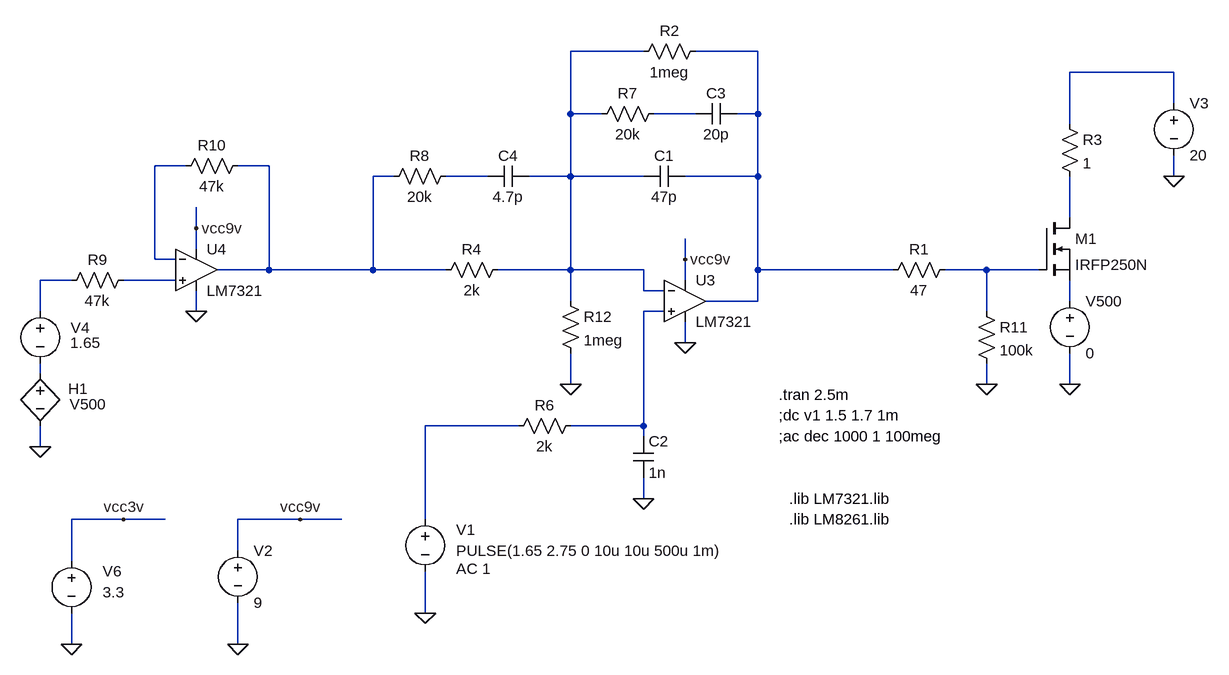
[diagram p0: schematic power_mosfet.asc]
power_mosfet.asc, the LTspice schematic file:
Version 4
SHEET 1 880 1104
WIRE -864 -128 -976 -128
WIRE -688 -128 -784 -128
WIRE -48 -96 -208 -96
WIRE -48 -48 -48 -96
WIRE -976 -32 -976 -128
WIRE -928 -32 -976 -32
WIRE -784 -32 -848 -32
WIRE -688 -32 -688 -128
WIRE -688 -32 -720 -32
WIRE -208 -16 -208 -96
WIRE -1568 48 -1616 48
WIRE -1440 48 -1488 48
WIRE -1248 64 -1280 64
WIRE -1104 64 -1168 64
WIRE -976 64 -976 -32
WIRE -976 64 -1040 64
WIRE -864 64 -976 64
WIRE -688 64 -688 -32
WIRE -688 64 -800 64
WIRE -48 64 -48 32
WIRE -208 128 -208 64
WIRE -1552 144 -1552 112
WIRE -1552 176 -1552 144
WIRE -1616 192 -1616 48
WIRE -1584 192 -1616 192
WIRE -800 192 -800 160
WIRE -1440 208 -1440 48
WIRE -1440 208 -1520 208
WIRE -1280 208 -1280 64
WIRE -1280 208 -1440 208
WIRE -1168 208 -1280 208
WIRE -976 208 -976 64
WIRE -976 208 -1088 208
WIRE -864 208 -976 208
WIRE -688 208 -688 64
WIRE -480 208 -688 208
WIRE -336 208 -400 208
WIRE -256 208 -336 208
WIRE -1744 224 -1792 224
WIRE -1584 224 -1664 224
WIRE -800 224 -800 192
WIRE -864 240 -864 208
WIRE -832 240 -864 240
WIRE -976 256 -976 208
WIRE -688 256 -688 208
WIRE -688 256 -768 256
WIRE -208 256 -208 224
WIRE -1792 272 -1792 224
WIRE -1552 272 -1552 240
WIRE -832 272 -864 272
WIRE -336 272 -336 208
WIRE -800 320 -800 288
WIRE -1792 368 -1792 352
WIRE -976 384 -976 336
WIRE -336 384 -336 352
WIRE -208 384 -208 336
WIRE -1056 448 -1200 448
WIRE -864 448 -864 272
WIRE -864 448 -976 448
WIRE -864 464 -864 448
WIRE -1792 480 -1792 448
WIRE -864 560 -864 528
WIRE -1664 592 -1744 592
WIRE -1600 592 -1664 592
WIRE -1392 592 -1488 592
WIRE -1328 592 -1392 592
WIRE -1200 592 -1200 448
WIRE -1488 640 -1488 592
WIRE -1744 656 -1744 592
WIRE -1200 736 -1200 672
WIRE -1744 784 -1744 736
WIRE -1488 784 -1488 720
FLAG -208 384 0
FLAG -48 64 0
FLAG -1792 480 0
FLAG -800 320 0
FLAG -800 192 vcc9v
FLAG -976 384 0
FLAG -336 384 0
FLAG -1488 784 0
FLAG -1392 592 vcc9v
FLAG -1552 272 0
FLAG -1552 144 vcc9v
FLAG -1744 784 0
FLAG -1664 592 vcc3v
FLAG -1200 736 0
FLAG -864 560 0
SYMBOL nmos -256 128 R0
SYMATTR InstName M1
SYMATTR Value IRFP250N
SYMBOL res -496 224 R270
WINDOW 0 32 56 VTop 2
WINDOW 3 0 56 VBottom 2
SYMATTR InstName R1
SYMATTR Value 47
SYMBOL voltage -48 -64 R0
WINDOW 123 0 0 Left 2
WINDOW 39 0 0 Left 2
SYMATTR InstName V3
SYMATTR Value 20
SYMBOL res -224 -32 R0
SYMATTR InstName R3
SYMATTR Value 1
SYMBOL h -1792 352 R0
WINDOW 0 43 39 Left 2
WINDOW 3 45 63 Left 2
SYMATTR InstName H1
SYMATTR Value V500
SYMATTR Value2 110m
SYMBOL voltage -208 240 R0
WINDOW 123 0 0 Left 2
WINDOW 39 0 0 Left 2
SYMATTR InstName V500
SYMATTR Value 0
SYMBOL voltage -1792 256 R0
WINDOW 0 47 41 Left 2
WINDOW 3 46 64 Left 2
WINDOW 123 0 0 Left 2
WINDOW 39 0 0 Left 2
SYMATTR InstName V4
SYMATTR Value 1.65
SYMBOL res -1184 224 R270
WINDOW 0 32 56 VTop 2
WINDOW 3 0 56 VBottom 2
SYMATTR InstName R4
SYMATTR Value 2k
SYMBOL cap -864 80 R270
WINDOW 0 32 32 VTop 2
WINDOW 3 0 32 VBottom 2
SYMATTR InstName C1
SYMATTR Value 47p
SYMBOL res -880 -112 R270
WINDOW 0 32 56 VTop 2
WINDOW 3 0 56 VBottom 2
SYMATTR InstName R2
SYMATTR Value 1meg
SYMBOL res -944 -16 R270
WINDOW 0 32 56 VTop 2
WINDOW 3 0 56 VBottom 2
SYMATTR InstName R7
SYMATTR Value 20k
SYMBOL cap -784 -16 R270
WINDOW 0 32 32 VTop 2
WINDOW 3 0 32 VBottom 2
SYMATTR InstName C3
SYMATTR Value 20p
SYMBOL res -1264 80 R270
WINDOW 0 32 56 VTop 2
WINDOW 3 0 56 VBottom 2
SYMATTR InstName R8
SYMATTR Value 20k
SYMBOL cap -1104 80 R270
WINDOW 0 32 32 VTop 2
WINDOW 3 0 32 VBottom 2
SYMATTR InstName C4
SYMATTR Value 4.7p
SYMBOL res -352 256 R0
SYMATTR InstName R11
SYMATTR Value 100k
SYMBOL voltage -1488 624 R0
WINDOW 123 0 0 Left 2
WINDOW 39 0 0 Left 2
SYMATTR InstName V2
SYMATTR Value 9
SYMBOL res -1648 208 R90
WINDOW 0 0 56 VBottom 2
WINDOW 3 32 56 VTop 2
SYMATTR InstName R9
SYMATTR Value 47k
SYMBOL res -1472 32 R90
WINDOW 0 0 56 VBottom 2
WINDOW 3 32 56 VTop 2
SYMATTR InstName R10
SYMATTR Value 47k
SYMBOL res -992 240 R0
SYMATTR InstName R12
SYMATTR Value 1meg
SYMBOL voltage -1744 640 R0
WINDOW 123 24 124 Left 2
WINDOW 39 0 0 Left 2
WINDOW 0 48 32 Left 2
WINDOW 3 48 64 Left 2
SYMATTR InstName V6
SYMATTR Value 3.3
SYMBOL Opamps\\opamp2 -800 192 R0
SYMATTR InstName U3
SYMATTR Value LM7321
SYMBOL Opamps\\opamp2 -1552 144 R0
SYMATTR InstName U4
SYMATTR Value LM7321
SYMBOL voltage -1200 576 R0
WINDOW 123 48 92 Left 2
WINDOW 39 0 0 Left 2
WINDOW 0 48 32 Left 2
WINDOW 3 48 64 Left 2
SYMATTR Value2 AC 1
SYMATTR InstName V1
SYMATTR Value PULSE(1.65 2.75 0 10u 10u 500u 1m)
SYMBOL res -960 432 R90
WINDOW 0 0 56 VBottom 2
WINDOW 3 32 56 VTop 2
SYMATTR InstName R6
SYMATTR Value 2k
SYMBOL cap -880 464 R0
SYMATTR InstName C2
SYMATTR Value 1n
TEXT -656 400 Left 2 !.tran 2.5m
TEXT -640 592 Left 2 !.lib LM8261.lib
TEXT -640 560 Left 2 !.lib LM7321.lib
TEXT -656 464 Left 2 !;ac dec 1000 1 100meg
TEXT -656 432 Left 2 !;dc v1 1.5 1.7 1m

The netlist it stands for:
* power_mosfet.asc
M1 N008 N009 N012 N012 IRFP250N
R1 N002 N009 47
V3 N003 0 20
R3 N003 N008 1
H1 N014 0 V500 110m
V500 N012 0 0
V4 N010 N014 1.65
R4 N006 N001 2k
C1 N001 N002 47p
R2 N001 N002 1meg
R7 N001 N004 20k
C3 N004 N002 20p
R8 N006 N007 20k
C4 N007 N001 4.7p
R11 N009 0 100k
V2 vcc9v 0 9
R9 N011 N010 47k
R10 N006 N005 47k
R12 N001 0 1meg
V6 vcc3v 0 3.3
XU3 N013 N001 vcc9v 0 N002 LM7321  ; pins In+ In- V+ V- OUT
XU4 N011 N005 vcc9v 0 N006 LM7321  ; pins In+ In- V+ V- OUT
V1 N015 0 PULSE(1.65 2.75 0 10u 10u 500u 1m) AC 1
R6 N013 N015 2k
C2 N013 0 1n
.model NMOS NMOS
.model PMOS PMOS
.lib standard.mos
.tran 2.5m
.lib LM8261.lib
.lib LM7321.lib
;ac dec 1000 1 100meg
;dc v1 1.5 1.7 1m
.backanno
.end